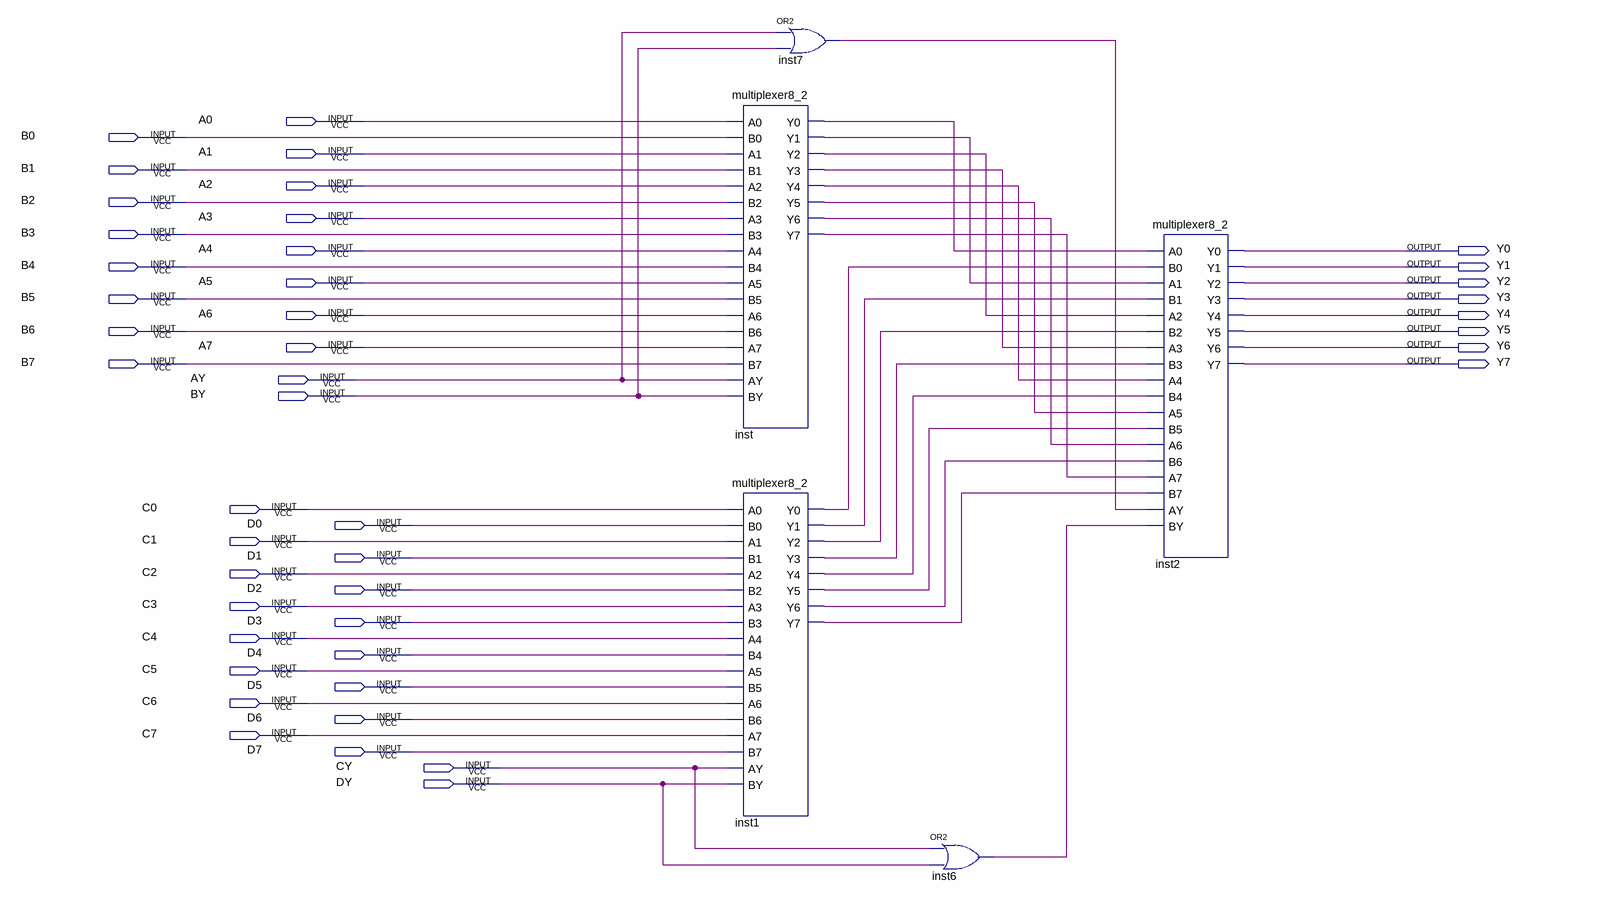
[diagram p0: schematic sheet]
// Quartus schematic multiplexer8_4.bdf as structural Verilog: 5 symbols, 44 pins
module multiplexer8_4 (
  input  A0,
  input  B0,
  input  A1,
  input  B1,
  input  A2,
  input  B2,
  input  A3,
  input  B3,
  input  A4,
  input  B4,
  input  A5,
  input  B5,
  input  A6,
  input  B6,
  input  A7,
  input  B7,
  input  AY,
  input  BY,
  input  C0,
  input  D0,
  input  C1,
  input  D1,
  input  C2,
  input  D2,
  input  C3,
  input  D3,
  input  C4,
  input  D4,
  input  C5,
  input  D5,
  input  C6,
  input  D6,
  input  C7,
  input  D7,
  input  CY,
  input  DY,
  output Y0,
  output Y1,
  output Y2,
  output Y3,
  output Y4,
  output Y5,
  output Y6,
  output Y7
);

  wire inst1_y0, inst1_y1, inst1_y2, inst1_y3, inst1_y4, inst1_y5, inst1_y6, inst1_y7, inst6_out, inst7_out,
       inst_y0, inst_y1, inst_y2, inst_y3, inst_y4, inst_y5, inst_y6, inst_y7;

  multiplexer8_2 inst (
    .A0(A0), .B0(B0), .A1(A1), .B1(B1), .A2(A2), .B2(B2), .A3(A3), .B3(B3), .A4(A4), .B4(B4), .A5(A5),
    .B5(B5), .A6(A6), .B6(B6), .A7(A7), .B7(B7), .AY(AY), .BY(BY), .Y0(inst_y0), .Y1(inst_y1), .Y2(inst_y2),
    .Y3(inst_y3), .Y4(inst_y4), .Y5(inst_y5), .Y6(inst_y6), .Y7(inst_y7));
  multiplexer8_2 inst1 (
    .A0(C0), .B0(D0), .A1(C1), .B1(D1), .A2(C2), .B2(D2), .A3(C3), .B3(D3), .A4(C4), .B4(D4), .A5(C5),
    .B5(D5), .A6(C6), .B6(D6), .A7(C7), .B7(D7), .AY(CY), .BY(DY), .Y0(inst1_y0), .Y1(inst1_y1),
    .Y2(inst1_y2), .Y3(inst1_y3), .Y4(inst1_y4), .Y5(inst1_y5), .Y6(inst1_y6), .Y7(inst1_y7));
  or inst7 (inst7_out, AY, BY);
  or inst6 (inst6_out, CY, DY);
  multiplexer8_2 inst2 (
    .A0(inst_y0), .B0(inst1_y0), .A1(inst_y1), .B1(inst1_y1), .A2(inst_y2), .B2(inst1_y2), .A3(inst_y3),
    .B3(inst1_y3), .A4(inst_y4), .B4(inst1_y4), .A5(inst_y5), .B5(inst1_y5), .A6(inst_y6), .B6(inst1_y6),
    .A7(inst_y7), .B7(inst1_y7), .AY(inst7_out), .BY(inst6_out), .Y0(Y0), .Y1(Y1), .Y2(Y2), .Y3(Y3), .Y4(Y4),
    .Y5(Y5), .Y6(Y6), .Y7(Y7));
endmodule
